# EAGLE design MEMS-preamp_v06_Labels (EAGLE 8.5.0)
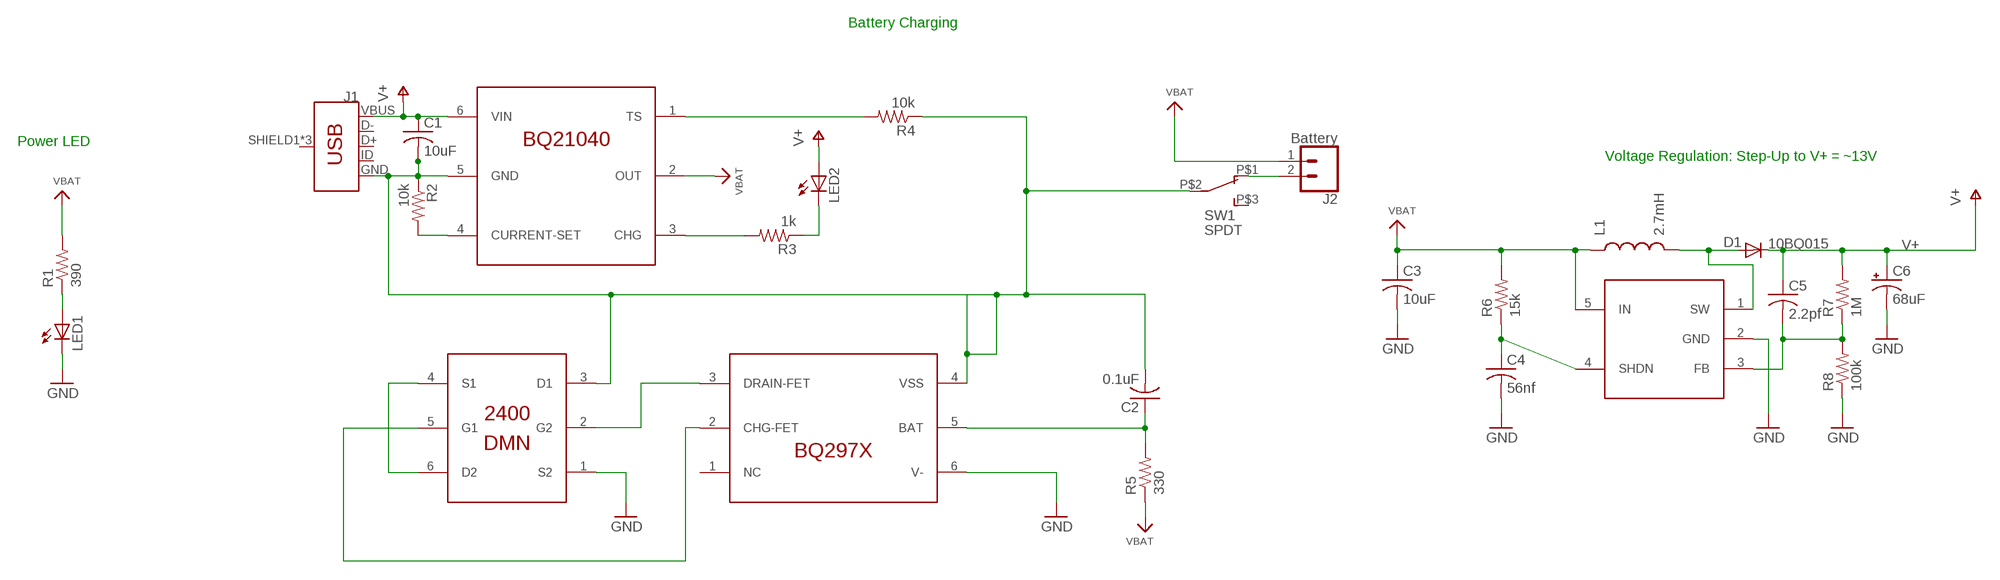
[diagram p0: schematic, sheet 1, part 1 of 2]
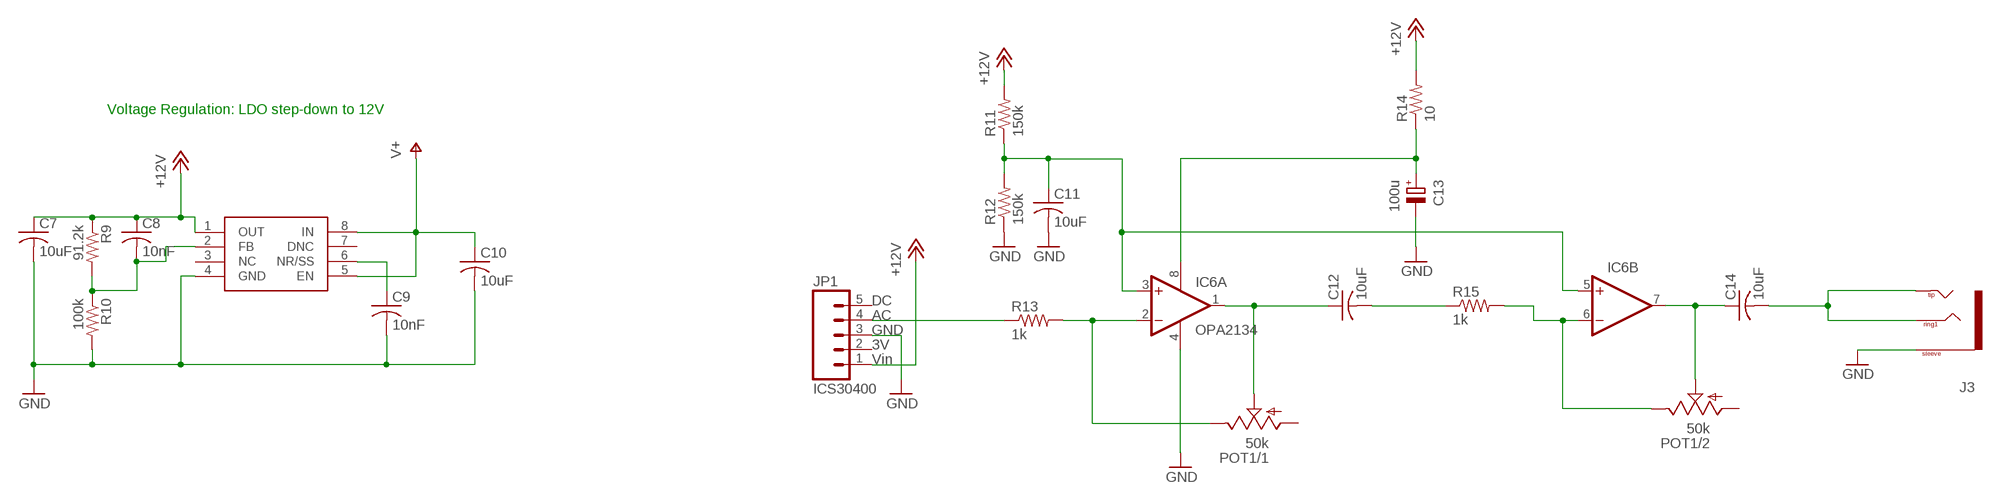
[diagram p1: schematic, sheet 1, part 2 of 2]

## Parts
C1  10uF  C-USC0603  [C0603]
C2  0.1uF  C-USC0603  [C0603]
C3  10uF  C-USC0603  [C0603]
C4  56nf  C-USC0603  [C0603]
C5  2.2pf  C-USC0603  [C0603]
C6  68uF  CAP_POL3528  [EIA3528]
C7  10uF  C-USC0603  [C0603]
C8  10nF  C-USC0603  [C0603]
C9  10nF  C-USC0603  [C0603]
C10  10uF  C-USC0603  [C0603]
C11  10uF  C-USC0603  [C0603]
C12  10uF  C-USC0805  [C0805]
C13  100u  CPOL-EUCT7343  [CT7343]
C14  10uF  C-USC0603  [C0603]
D1  10BQ015  DIODESMA  [SMA-DIODE]
IC1  DMN2400  DUAL-NFET-DMN2400  [SOT-563]
IC2  BQ21040  BQ21040-LIPO-CHARGER  [SOT23-6]
IC3  BQ297X  BQ297X-BATTERY-MANAGER  [WSON-6]
IC4  SC4503  [SOT23-5]
IC5  TPS7A49  [MSOP-8]
IC6  OPA2134  OPA2134UA  [SO08]
J1  USB_MICRO-BREDUCED_PASTE  [USB-B-MICRO-SMD_RED_PASTE]
J2  Battery  CONN_02LOCK  [1X02_LOCK]
J3  TRS-1/8"-3.5MM  [TRS_SJ-3524-SMT]
JP1  ICS30400  M05LOCK  [1X05_LOCK]
L1  2.7mH  INDUCTORCR54-KIT  [CR54-KIT]
LED1  LED3MM  [LED3MM]
LED2  LED3MM  [LED3MM]
POT1  50k  POT-DUAL-PTV112-4420  [PTV112]
R1  390  R-US_R0603  [R0603]
R2  10k  R-US_R0603  [R0603]
R3  1k  R-US_R0603  [R0603]
R4  10k  R-US_R0603  [R0603]
R5  330  R-US_R0603  [R0603]
R6  15k  R-US_R0603  [R0603]
R7  1M  R-US_R0603  [R0603]
R8  100k  R-US_R0603  [R0603]
R9  91.2k  R-US_R0603  [R0603]
R10  100k  R-US_R0603  [R0603]
R11  150k  R-US_R0603  [R0603]
R12  150k  R-US_R0603  [R0603]
R13  1k  R-US_R0603  [R0603]
R14  10  R-US_R0603  [R0603]
R15  1k  R-US_R0603  [R0603]
SW1  SPDT  SWITCH_SPDTCL-SB-12B  [SWITCH_SPDT_CL-SB-12B]

## Nets
+12V: C7.1 C8.1 IC5.1(OUT) JP1.1 R9.1 R11.2 R14.2
GND: C3.2 C4.2 C6.C(-) C7.2 C9.2 C10.2 C11.2 C13.- IC1.1(S2) IC3.6(V-) IC5.4(GND) IC6.4(A:V-) J3.1(SLEEVE) JP1.3 LED1.K(C) R8.1 R10.2 R12.1
GND2: C1.2 C2.2 IC1.3(D1) IC2.5(GND) IC3.4(VSS) J1.GND R2.1 R4.1 SW1.P$2
GROU[: IC6.6(B:-IN) POT1.2.3(/2:E) R15.2
N$1: C13.+ IC6.8(A:V+) R14.1
N$2: LED1.A R1.1
N$3: JP1.4 R13.1
N$4: C12.2 R15.1
N$5: IC6.2(A:-IN) POT1.1.3(/1:E) R13.2
N$6: J2.2 SW1.P$1
N$7: C14.2 J3.2(TIP) J3.3(RING1) J3.4(TIP)
N$8: C11.1 IC6.3(A:+IN) IC6.5(B:+IN) R11.1 R12.2
N$9: C12.1 IC6.1(A:OUT) POT1.1.2(/1:S)
N$10: C14.1 IC6.7(B:OUT) POT1.2.2(/2:S)
N$11: LED2.K(C) R3.1
N$12: D1.A IC4.1(SW) L1.P$2
N$13: C4.1 IC4.4(SHDN) R6.1
N$14: C5.2 IC4.3(FB) R7.1 R8.2
N$15: IC2.3(CHG) R3.2
N$16: IC2.1(TS) R4.2
N$17: IC2.4(CURRENT-SET) R2.2
N$18: C2.1 IC3.5(BAT) R5.2
N$19: IC1.4(S1) IC1.6(D2)
N$20: IC1.5(G1) IC3.2(CHG-FET)
N$22: IC1.2(G2) IC3.3(DRAIN-FET)
N$47: C8.2 IC5.2(FB) R9.2 R10.1
N$48: C9.1 IC5.6(NR/SS)
V+: C1.1 C5.1 C6.A(+) C10.1 D1.C IC2.6(VIN) IC5.5(EN) IC5.8(IN) J1.VBUS LED2.A R7.2
VBAT: C3.1 IC2.2(OUT) IC4.5(IN) J2.1 L1.P$1 R1.2 R5.1 R6.2
Unconnected: IC3.1(NC) IC4.2(GND) IC5.3(NC) IC5.7(DNC) J1.D+ J1.D- J1.ID J1.SHIELD1(SHIELD) J1.SHIELD2(SHIELD) J1.SHIELD3(SHIELD) JP1.2 JP1.5 POT1.1.1(/1:A) POT1.2.1(/2:A) SW1.P$3

## Notes on the sheet
- Battery Charging
- Power LED
- Voltage Regulation: Step-Up to V+ = ~13V | Voltage Regulation: LDO step-down to 12V

## Library data of the parts
C1-C5 C7-C12 C14 = adafruit:C-US: CAPACITOR, American symbol
C6 = SparkFun:CAP_POL: Capacitor Polarized These are standard SMD and PTH capacitors. Normally 10uF, 47uF, and 100uF in electrolytic and tantalum varieties. Always verify the external diameter of the through hole cap, it varies with capacity, voltage, and manufacturer. The EIA devices should be standard.
C13 = rcl:CPOL-EU: POLARIZED CAPACITOR, European symbol
D1 = SparkFun:DIODE: Diode These are standard reverse protection diodes and small signal diodes. SMA package can handle up to about 1A. SOD-323 can handle about 200mA. What the SOD-323 package when ordering, there are some mfgs out there that are 5-pin packages.
IC1 = CMU-ArtFab:DUAL-NFET-DMN2400
IC2 = CMU-ArtFab:BQ21040-LIPO-CHARGER
IC3 = CMU-ArtFab:BQ297X-BATTERY-MANAGER
IC4 = CMU-ArtFab:SC4503
IC5 = CMU-ArtFab:TPS7A49
IC6 = linear:OPA2*: Dual Operational Amplifier Low Power, Single-Supply, Rail-To-Rail Operational Amplifier Source: http://focus.ti.com/lit/ds/symlink/opa2345.pdf http://focus.ti.com .. opa241.pdf http://focus.ti.com/lit/ds/symlink/opa2134.pdf; IC_NAME: OPA2134
J1 = SparkFun-Connectors:USB_MICRO-B: USB Type Micro-B Connector Male/female and PTH/SMT variants SparkFun Products: SparkFun microB USB Breakout <https://www.sparkfun.com/products/12035> SparkFun USB microB Plug Breakout <https://www.sparkfun.com/products/10031> SparkFun ESP8266 Thing <https://www.sparkfun.com/products/13231>; PROD_ID: CONN-11752
J2 = SparkFun-Connectors:CONN_02: Multi connection point. Often used as Generic Header-pin footprint for 0.1 inch spaced/style header connections On any of the 0.1 inch spaced packages, you can populate with these: Break Away Headers - Straight <https://www.sparkfun.com/products/116> (PRT-00116) Break Away Male Headers - Right Angle <https://www.sparkfun.com/products/553> (PRT-00553) Female Headers <https://www.sparkfun.com/products/115> (PRT-00115) Break Away Headers - Machine Pin <https://www.sparkfun.com/products/117> (PRT-00117) Break Away Female Headers - Swiss Machine Pin <https://www.sparkfun.com/products/743> (PRT-00743) For SCREWTERMINALS and SPRING TERMINALS visit here: Screw Terimnals on SparkFun.com <https://www.sparkfun.com/search/results?term=Screw+Terminals> (5mm/3.5mm/2.54mm spacing) This device is also useful as a general connection point to wire up your design to another part of your project. Our various solder wires solder well into these plated through hole pads. Hook-Up Wire - Assortment (Stranded, 22 AWG) <https://www.sparkfun.com/products/11375> (PRT-11375) Hook-Up Wire - Assortment (Solid Core, 22 AWG) <https://www.sparkfun.com/products/11367> (PRT-11367) View the entire wire category on our website here <https://www.sparkfun.com/categories/141> Special notes: Molex polarized connector foot print use with: PRT-08233 with associated crimp pins and housings. 2.54_SCREWTERM for use with PRT-10571. 3.5mm Screw Terminal footprints for PRT-08084 5mm Screw Terminal footprints for use with PRT-08432
J3 = CMU-ArtFab:TRS-1/8"-3.5MM
JP1 = SparkFun-Connectors:M05: Header 5 Standard 5-pin 0.1" header. Use with straight break away headers (SKU : PRT-00116), right angle break away headers (PRT-00553), swiss pins (PRT-00743), machine pins (PRT-00117), and female headers (PRT-00115). Molex polarized connector foot print use with SKU : PRT-08230 with associated crimp pins and housings.; CON1: Vin; CON2: 3V; CON3: GND; CON4: AC; CON5: DC
L1 = SparkFun-Passives:INDUCTOR: Inductors Basic Inductor/Choke - 0603 and 1206. Footprints are not proven and vary greatly between part numbers. SRN6045- 33uH, 20% 1.4A SDR0403-560KL - 56uH, 10%, 500mA RMS/740mA peak
LED1 LED2 = led:LED: LED OSRAM: - CHIPLED LG R971, LG N971, LY N971, LG Q971, LY Q971, LO R971, LY R971 LH N974, LH R974 LS Q976, LO Q976, LY Q976 LO Q996 - Hyper CHIPLED LW Q18S LB Q993, LB Q99A, LB R99A - SideLED LS A670, LO A670, LY A670, LG A670, LP A670 LB A673, LV A673, LT A673, LW A673 LH A674 LY A675 LS A676, LA A676, LO A676, LY A676, LW A676 LS A679, LY A679, LG A679 - Hyper Micro SIDELED® LS Y876, LA Y876, LO Y876, LY Y876 LT Y87S - SmartLED LW L88C, LW L88S LB L89C, LB L89S, LG L890 LS L89K, LO L89K, LY L89K LS L896, LA L896, LO L896, LY L896 - TOPLED LS T670, LO T670, LY T670, LG T670, LP T670 LSG T670, LSP T670, LSY T670, LOP T670, LYG T670 LG T671, LOG T671, LSG T671 LB T673, LV T673, LT T673, LW T673 LH T674 LS T676, LA T676, LO T676, LY T676, LB T676, LH T676, LSB T676, LW T676 LB T67C, LV T67C, LT T67C, LS T67K, LO T67K, LY T67K, LW E67C LS E67B, LA E67B, LO E67B, LY E67B, LB E67C, LV E67C, LT E67C LW T67C LS T679, LY T679, LG T679 LS T770, LO T770, LY T770, LG T770, LP T770 LB T773, LV T773, LT T773, LW T773 LH T774 LS E675, LA E675, LY E675, LS T675 LS T776, LA T776, LO T776, LY T776, LB T776 LHGB T686 LT T68C, LB T68C - Hyper Mini TOPLED® LB M676 - Mini TOPLED Santana® LG M470 LS M47K, LO M47K, LY M47K Source: http://www.osram.convergy.de LUXEON: - LUMILED® LXK2-PW12-R00, LXK2-PW12-S00, LXK2-PW14-U00, LXK2-PW14-V00 LXK2-PM12-R00, LXK2-PM12-S00, LXK2-PM14-U00 LXK2-PE12-Q00, LXK2-PE12-R00, LXK2-PE12-S00, LXK2-PE14-T00, LXK2-PE14-U00 LXK2-PB12-K00, LXK2-PB12-L00, LXK2-PB12-M00, LXK2-PB14-N00, LXK2-PB14-P00, LXK2-PB14-Q00 LXK2-PR12-L00, LXK2-PR12-M00, LXK2-PR14-Q00, LXK2-PR14-R00 LXK2-PD12-Q00, LXK2-PD12-R00, LXK2-PD12-S00 LXK2-PH12-R00, LXK2-PH12-S00 LXK2-PL12-P00, LXK2-PL12-Q00, LXK2-PL12-R00 Source: www.luxeon.com KINGBRIGHT: KA-3528ASYC Source: www.kingbright.com
POT1 = CMU-ArtFab:POT-DUAL-PTV112: Bourns 11mm dual potentiometer; AVAILABILITY: Unavailable; DESCRIPTION: Alt# Tce-10111410; MF: STMicroelectronics; MP: PTV112; PACKAGE: None; PRICE: None
R1-R15 = CMU-ArtFab:R-US_: RESISTOR, American symbol
SW1 = CMU-ArtFab:SWITCH_SPDT

## Board
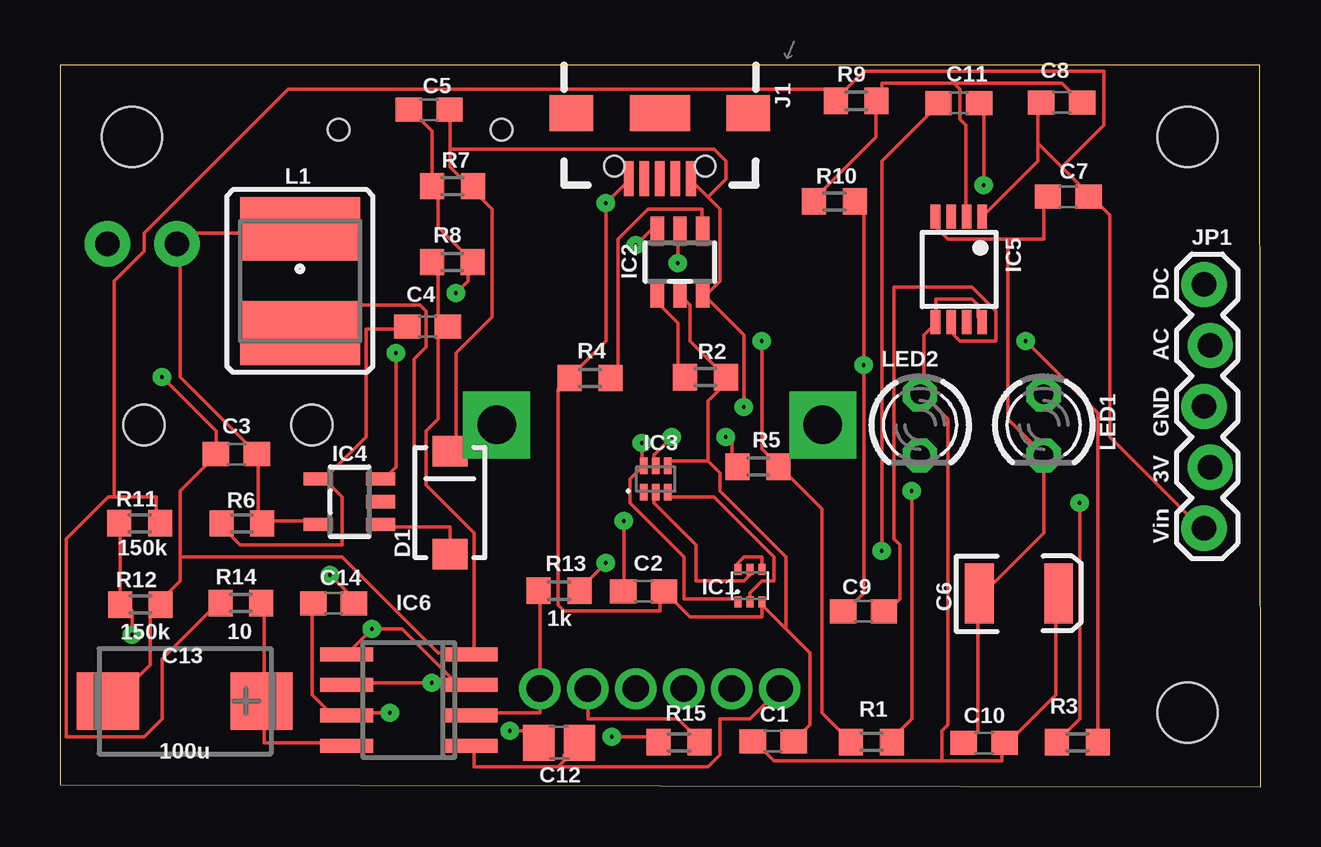
[diagram p2: board, top side]
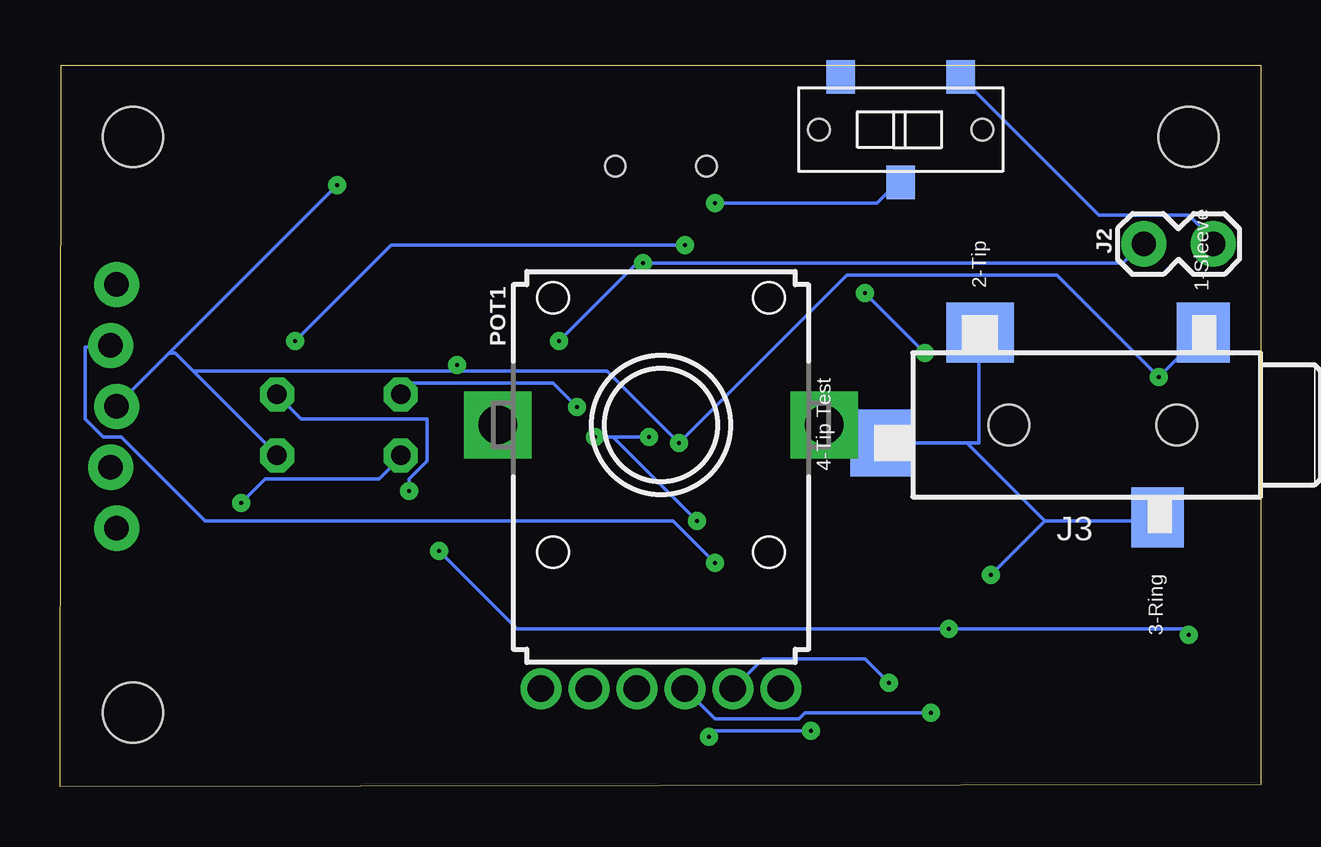
[diagram p3: board, bottom side, seen from below]

Size 50.05 x 30.09 mm. Coordinates in mm from the lower left corner, seen from the top.
Outline: 0,0.08 50.05,0 50,30.09 0,30.09 0,0.08
Copper layers (1*16): Top 0.035mm / dielectric 1.5mm / Bottom 0.035mm
Design rules "default *": minimum track width 6mil, minimum drill 6mil, track to track 6mil, track to pad 6mil, pad to pad 6mil, via to via 6mil, smd to smd 6mil, copper to edge 6mil, drill to drill 6mil, minimum pad ring 12mil, minimum via ring 12mil, stop-mask expansion 4mil, vias tented up to drill 0mil, thermal gap 10mil
Holes 2.5 mm at 47,27.09 47,3.08 3,27.09

### Footprints (pad centres in the part's own frame; a part is rotated, then mirrored left to right if it is on the bottom)
C0603 = smd 1.1 x 1: 1 -0.85,0; 2 0.85,0
EIA3528 = smd 1.2 x 2.5: A 1.65,0; C -1.65,0
C0805 = smd 1.3 x 1.5: 1 -0.85,0; 2 0.85,0
CT7343 = smd 2.6 x 2.4: + -3.2,0; - 3.2,0
SMA-DIODE = smd 1.27 x 1.47: A -2.15,0; C 2.15,0
SOT-563 = smd 0.3 x 0.45: 1 -0.5,-0.675; 2 0,-0.675; 3 0.5,-0.675; 4 0.5,0.675; 5 0,0.675; 6 -0.5,0.675
SOT23-6 = smd 0.55 x 1.2: 1 -0.95,-1.3; 2 0,-1.3; 3 0.95,-1.3; 4 0.95,1.3; 5 0,1.3; 6 -0.95,1.3
WSON-6 = smd 0.3 x 0.7: 1 -0.5,-0.55; 2 0,-0.55; 3 0.5,-0.55; 4 0.5,0.55; 5 0,0.55; 6 -0.5,0.55
SOT23-5 = smd 0.55 x 1.2: 1 -0.95,-1.3; 2 0,-1.3; 3 0.95,-1.3; 4 0.95,1.3; 5 -0.95,1.3
MSOP-8 = smd 0.4 x 1: 1 -0.975,-2.2; 2 -0.325,-2.2; 3 0.325,-2.2; 4 0.975,-2.2; 5 0.975,2.2; 6 0.325,2.2; 7 -0.325,2.2; 8 -0.975,2.2
SO08 = smd 0.6 x 2.2: 1 -1.905,-2.6; 2 -0.635,-2.6; 3 0.635,-2.6; 4 1.905,-2.6; 5 1.905,2.6; 6 0.635,2.6; 7 -0.635,2.6; 8 -1.905,2.6
USB-B-MICRO-SMD_RED_PASTE = smd 1.45 x 0.4: D+ 2.725,0; D- 2.725,0.65; GND 2.725,-1.3; ID 2.725,-0.65; VBUS 2.725,1.3 | smd 1.5 x 1.8: SHIELD1 0,3.685; SHIELD2 0,-3.685 | smd 1.5 x 2.5: SHIELD3 0,0 | hole 0.85: 2.2,1.9; 2.2,-1.9
1X02_LOCK = drill 1.016 pad 1.88: 1 -0.178,0; 2 2.718,0
TRS_SJ-3524-SMT = smd 2.5 x 2.2: 1 3.85,-4.6; 3 -3.85,-2.7 | smd 2.5 x 2.8: 2 3.85,4.7 | smd 2.8 x 2.5: 4 -0.75,8.85 | hole 1.7: 0,-3.5; 0,3.5
1X05_LOCK = drill 1.016 pad 1.88: 1 0,0.127; 2 2.54,-0.127; 3 5.08,0.127; 4 7.62,-0.127; 5 10.16,0.127
CR54-KIT = smd 5 x 2.65: P$1 0,2.17; P$2 0,-2.17
LED3MM = drill 0.813 octagon: A -1.27,0; K 1.27,0
PTV112 = drill 1.1 pad 1.676: 1.1 -3,-11; 1.2 -5,-11; 1.3 5,-11; 2.1 -1,-11; 2.2 1,-11; 2.3 3,-11 | drill 1.6 pad 2.8 square: M1 -6.8,0; M2 6.8,0
R0603 = smd 1 x 1.1: 1 -0.85,0; 2 0.85,0
SWITCH_SPDT_CL-SB-12B = smd 1.2 x 1.4: P$1 -2.5,-2.2; P$2 0,2.2; P$3 2.5,-2.2 | hole 0.9: -3.4,0; 3.4,0

### Placement (x,y rotation side)
C1  29.73,1.9 0 top
C2  24.33,8.14 0 top
C3  7.36,13.87 180 top
C4  15.32,19.18 0 top
C5  15.39,28.22 180 top
C6  39.97,8.07 0 top
C7  42.03,24.61 180 top
C8  41.75,28.52 0 top
C9  33.49,7.32 180 top
C10  38.52,1.83 180 top
C11  37.46,28.5 0 top
C12  20.81,1.84 180 top
C13  5.21,3.57 180 top
C14  11.4,7.66 0 top
D1  16.26,11.85 90 top
IC1  28.77,8.38 0 top
IC2  25.84,21.87 180 top
IC3  24.83,12.83 0 top
IC4  12.06,11.89 90 top
IC5  37.47,21.57 180 top
IC6  14.54,3.61 90 top
J1  25,28.07 270 top
J2  4.7,22.63 0 bottom
J3  7,15.09 90 bottom
JP1  47.81,10.78 90 top
L1  10,21.09 0 top
LED1  41,15.09 270 top
LED2  35.85,15.09 270 top
POT1  25,15.09 0 bottom
R1  33.83,1.87 180 top
R2  26.9,17.08 180 top
R3  42.41,1.86 0 top
R4  22.09,17.04 0 top
R5  29.1,13.35 180 top
R6  7.58,10.98 0 top
R7  16.36,25.04 0 top
R8  16.35,21.88 0 top
R9  33.18,28.59 0 top
R10  32.28,24.4 0 top
R11  3.33,10.98 0 top
R12  3.35,7.59 180 top
R13  20.8,8.18 180 top
R14  7.54,7.66 180 top
R15  25.8,1.86 0 top
SW1  15.01,27.4 180 bottom

### Tracks (layer width: path | path; a pad name or v marks a point on that pad's centre or on a via)
+12V
  Top 0.152: 2.25,12.09 4,12.09 4,11.09 R11.2 | 2.25,12.09 2,12.09 0.25,10.34 0.25,2.08 3.5,2.08 4.25,2.83 4.25,5.33 6.5,7.58 R14.2 | 40.75,26.84 40.75,28.34 C8.1 | 40.75,26.84 40.75,26.09 38.5,23.84 IC5.1 | 40.75,26.84 41.75,25.84 | 41.75,25.84 42.75,24.84 C7.1 43,24.59 43.75,23.84 43.75,14.59 47.5,10.84 JP1.1 | 41.75,25.84 43.5,27.59 43.5,29.84 33.5,29.84 32.5,28.84 R9.1 32.25,28.84 32.25,29.09 9.5,29.09 3.5,23.09 3.5,22.34 2.25,21.09 2.25,12.09
GND  (via drill 0.15)
  Top 0.152: R8.1 15.75,21.84 15.75,19.59 16,19.34 C4.2 16,19.09 15.75,18.84 15.75,15.34 15.25,14.84 15.25,12.59 17.25,10.59 17.25,5.58 IC6.4 17,5.58 15.75,5.58 11.75,9.59 5,9.59 | C13.- 2.25,3.58 3.75,5.08 3.75,7.33 4,7.58 R12.1 4.25,7.83 5,8.59 5,9.59 | 5,9.59 5,12.34 6.5,13.84 C3.2 6.5,14.09 6.5,14.84 v4.25,17.09 | C9.2 32.75,7.33 33.5,8.09 v33.5,17.59 33.5,24.09 33.25,24.34 R10.2 | C10.2 37.75,1.83 38.25,2.33 38.25,7.83 C6.C 38.5,8.09 41,10.59 LED1.K 41,13.84 39.5,15.34 39.5,22.84 | IC1.1 28.25,7.83 26,7.83 26,9.59 23.75,11.84 23.75,12.84 24.25,13.34 IC3.6 24.25,13.59 v24.25,14.34 | 39.5,22.84 41,22.84 41,24.59 C7.2 | 39.5,22.84 37,22.84 36.5,23.34 36.5,23.59 IC5.4 | v38.5,25.09 38.5,28.34 C11.2
  Bottom 0.152: J3.1 v4.25,17.09 8.5,21.34 17.25,21.34 v24.25,14.34 27.25,17.34 33.5,17.34 | 45.5,18.09 47.5,16.09 JP1.3 | 45.5,18.09 v38.5,25.09 | 44.5,17.34 45.25,18.09 45.5,18.09 | 44.5,17.34 41,13.84 LED1.K | 44.5,17.34 33.5,17.34 | 33.5,17.34 v33.5,17.59
GND2  (via drill 0.15)
  Top 0.152: J1.GND 23.75,25.34 v22.75,24.34 22.75,18.59 21.25,17.09 R4.1 21,16.84 20.75,16.59 20.75,7.58 21,7.33 25,7.33 25,8.09 C2.2 25.25,8.09 26.25,7.08 29.25,7.08 29.25,7.58 | 27,13.59 25.25,13.59 IC3.4 | 27,13.59 27,16.09 27.75,16.84 R2.1 26.25,18.59 26.25,20.09 26,20.34 IC2.5 | 30.25,6.58 31.25,5.58 31.25,2.58 30.75,2.08 C1.2 | 30.25,6.58 29.25,7.58 | 29.25,7.58 IC1.3 | 27,13.59 27.5,13.09 27.5,12.34 30.25,9.59 30.25,6.58
  Bottom 0.152: v22.75,24.34 16,24.34 15.25,25.09 SW1.P$2
GROU[  (via drill 0.15)
  Top 0.152: POT1.2.3 22,2.83 25.75,2.83 26.5,2.08 R15.2 | v15.5,4.33 12,4.33 IC6.6
  Bottom 0.152: v15.5,4.33 16.5,5.33 20.75,5.33 POT1.2.3
N$1
  Top 0.152: R14.1 8.5,7.58 8.5,3.58 C13.+ 8.5,3.33 8.5,1.83 11.75,1.83 IC6.8
N$2  (via drill 0.15)
  Top 0.152: v35.5,12.34 35.5,2.83 34.75,2.08 R1.1
  Bottom 0.152: v35.5,12.34 35.5,12.84 34.75,13.59 34.75,15.34 40,15.34 41,16.34 LED1.A
N$3  (via drill 0.15)
  Top 0.152: v22.75,9.34 21.75,8.34 R13.1
  Bottom 0.152: v22.75,9.34 24.5,11.09 44,11.09 47.5,14.59 48.25,14.59 49,15.34 49,18.34 48,18.34 JP1.4
N$4  (via drill 0.15)
  Top 0.152: v23,2.08 24.75,2.08 R15.1 | v18.75,2.33 19.75,2.33 19.75,2.08 C12.2
  Bottom 0.152: v23,2.08 22.75,2.33 v18.75,2.33
N$5
  Top 0.152: R13.2 20,8.09 POT1.1.3 20,3.08 17.25,3.08 IC6.2
N$6
  Bottom 0.152: SW1.P$1 12.5,29.59 6.75,23.84 3,23.84 2,22.84 J2.2
N$7  (via drill 0.15)
  Top 0.152: v11.25,8.84 12.25,7.83 C14.2
  Bottom 0.152: 9,11.09 v11.25,8.84 | 9,11.09 4.5,11.09 J3.3 | J3.4 12.25,14.34 | 12.25,14.34 11.75,14.34 11.75,18.84 J3.2 | 12.25,14.34 9,11.09
N$8  (via drill 0.15)
  Top 0.152: R11.1 2.5,10.84 2.5,7.83 R12.2 2.75,7.58 3,7.33 v3,6.33 | v34.25,9.84 34.25,26.09 36.5,28.34 C11.1 | IC6.5 12,5.58 v13,6.58 14.25,6.58 16.25,4.58 16.25,4.33 17,4.33 IC6.3
  Bottom 0.152: v34.25,9.84 31,6.58 v13,6.58 3.25,6.58 v3,6.33
N$9
  Top 0.152: 20.75,0.83 21,1.08 21,1.33 21.5,1.83 C12.1 | 20.75,0.83 17.25,0.83 17.25,1.58 IC6.1 | POT1.1.2 28.75,2.83 27.5,2.83 27.5,1.33 27,0.83 20.75,0.83
N$10  (via drill 0.15)
  Top 0.152: C14.1 10.5,7.58 10.5,3.83 11.25,3.08 11.75,3.08 IC6.7 12,3.08 v13.75,3.08
  Bottom 0.152: POT1.2.2 22.75,2.83 19.25,2.83 19,3.08 v13.75,3.08
N$11  (via drill 0.15)
  Top 0.152: v42.5,11.84 42.5,2.83 41.75,2.08 R3.1
  Bottom 0.152: v42.5,11.84 41.5,12.84 36.75,12.84 36,13.59 LED2.K
N$12
  Top 0.152: 14.75,10.84 16.25,10.84 16.25,9.84 D1.A | 14.75,10.84 13.5,10.84 IC4.1 | 14.75,10.84 14.75,17.84 15.25,18.34 15.25,19.84 15,20.09 10,20.09 L1.P$2
N$13
  Top 0.152: 11,12.84 11.75,12.09 11.75,10.09 7.5,10.09 6.75,10.84 R6.1 | 11,12.84 12.75,14.59 12.75,19.09 14.25,19.09 C4.1 | 11,12.84 IC4.4
N$14  (via drill 0.15)
  Top 0.152: C5.2 14.75,28.09 15.5,27.34 15.5,25.09 R7.1 15.75,24.84 15.75,23.34 17,22.09 R8.2 17,21.84 17,21.09 v16.5,20.59 | v14,18.09 14,13.34 13.5,12.84 IC4.3
  Bottom 0.152: v16.5,20.59 v14,18.09
N$15  (via drill 0.15)
  Top 0.152: v40.25,18.59 43.25,15.59 43.25,2.08 R3.2 | v24,22.59 24.75,23.34 IC2.3
  Bottom 0.152: v40.25,18.59 36.25,22.59 v24,22.59
N$16
  Top 0.152: R4.2 23,17.09 23.25,17.34 23.25,22.84 24.5,24.09 26.75,24.09 26.75,23.34 IC2.1
N$17
  Top 0.152: R2.2 26,17.09 25.75,17.34 25.75,19.34 25,20.09 25,20.34 IC2.4
N$18  (via drill 0.15)
  Top 0.152: v25.5,14.59 24.75,13.84 24.75,13.59 IC3.5 | v27.75,14.59 28,14.34 28,13.59 R5.2 | v23.5,11.09 23.5,8.34 C2.1
  Bottom 0.152: v27.75,14.59 27,14.59 | 27,14.59 v25.5,14.59 | 27,14.59 v23.5,11.09
N$19
  Top 0.152: IC1.6 28.25,9.09 28.25,9.34 28.5,9.59 29.25,9.59 29.25,9.09 IC1.4
N$20
  Top 0.152: IC1.5 28.75,8.84 28.5,8.59 26.5,8.59 26.5,10.09 24.75,11.84 24.75,12.09 IC3.2
N$22
  Top 0.152: IC1.2 28.75,7.83 28.75,8.09 29.25,8.59 29.75,8.59 29.75,9.59 27.25,12.09 25.25,12.09 IC3.3
N$47
  Top 0.152: 37.25,29.34 37.5,29.09 37.5,27.84 37.75,27.59 37.75,23.84 IC5.2 | 37.25,29.34 34.25,29.34 34.25,28.84 R9.2 34,28.59 34,27.09 31.5,24.59 R10.1 | 37.25,29.34 41.75,29.34 42.5,28.59 C8.2
N$48
  Top 0.152: IC5.6 37.25,19.34 37.25,18.84 37.5,18.59 39,18.59 39,19.84 38,20.84 34.75,20.84 34.75,10.34 35,10.09 35,7.83 34.5,7.33 C9.1
V+  (via drill 0.15)
  Top 0.152: 27,24.59 26.25,25.34 J1.VBUS | 27,24.59 27.5,24.09 27.5,21.09 27,20.59 IC2.6 27,20.34 28.5,18.84 v28.5,15.84 | 16.25,26.59 16.25,28.09 C5.1 | 16.25,26.59 16.25,25.84 17,25.09 R7.2 17.25,24.84 18,24.09 18,19.59 16.5,18.09 16.5,14.09 D1.C | 27,24.59 27.75,25.34 27.75,26.09 27.25,26.59 16.25,26.59 | IC5.8 38.25,19.59 38.25,20.09 38,20.34 36.5,20.34 36.5,19.59 IC5.5 36.5,19.34 36,18.84 36,16.59 LED2.A 36,16.34 37,15.34 37,2.58 36.75,2.33 36.75,1.08 | C6.A 41.5,7.83 41.5,3.83 39.5,1.83 C10.1 39.25,1.58 39.25,1.08 36.75,1.08 | 36.75,1.08 29.75,1.08 29,1.83 C1.1
  Bottom 0.152: v28.5,15.84 29.5,16.84 35.5,16.84 35.75,16.59 LED2.A
VBAT  (via drill 0.15)
  Top 0.152: R1.2 32.75,2.08 31.75,3.08 31.75,11.59 30,13.34 R5.1 29.75,13.59 29.25,14.09 v29.25,18.59 | IC4.5 10.75,11.09 8.5,11.09 R6.2 8.25,11.09 8.25,13.84 C3.1 8,14.09 5,17.09 5,22.59 J2.1 5,22.84 5,23.09 10,23.09 L1.P$1 | v25.75,21.84 25.75,23.09 IC2.2
  Bottom 0.152: J2.1 5,22.59 5.75,21.84 v25.75,21.84 26,21.84 v29.25,18.59